# EAGLE schematic V1 (EAGLE 6.5.0)
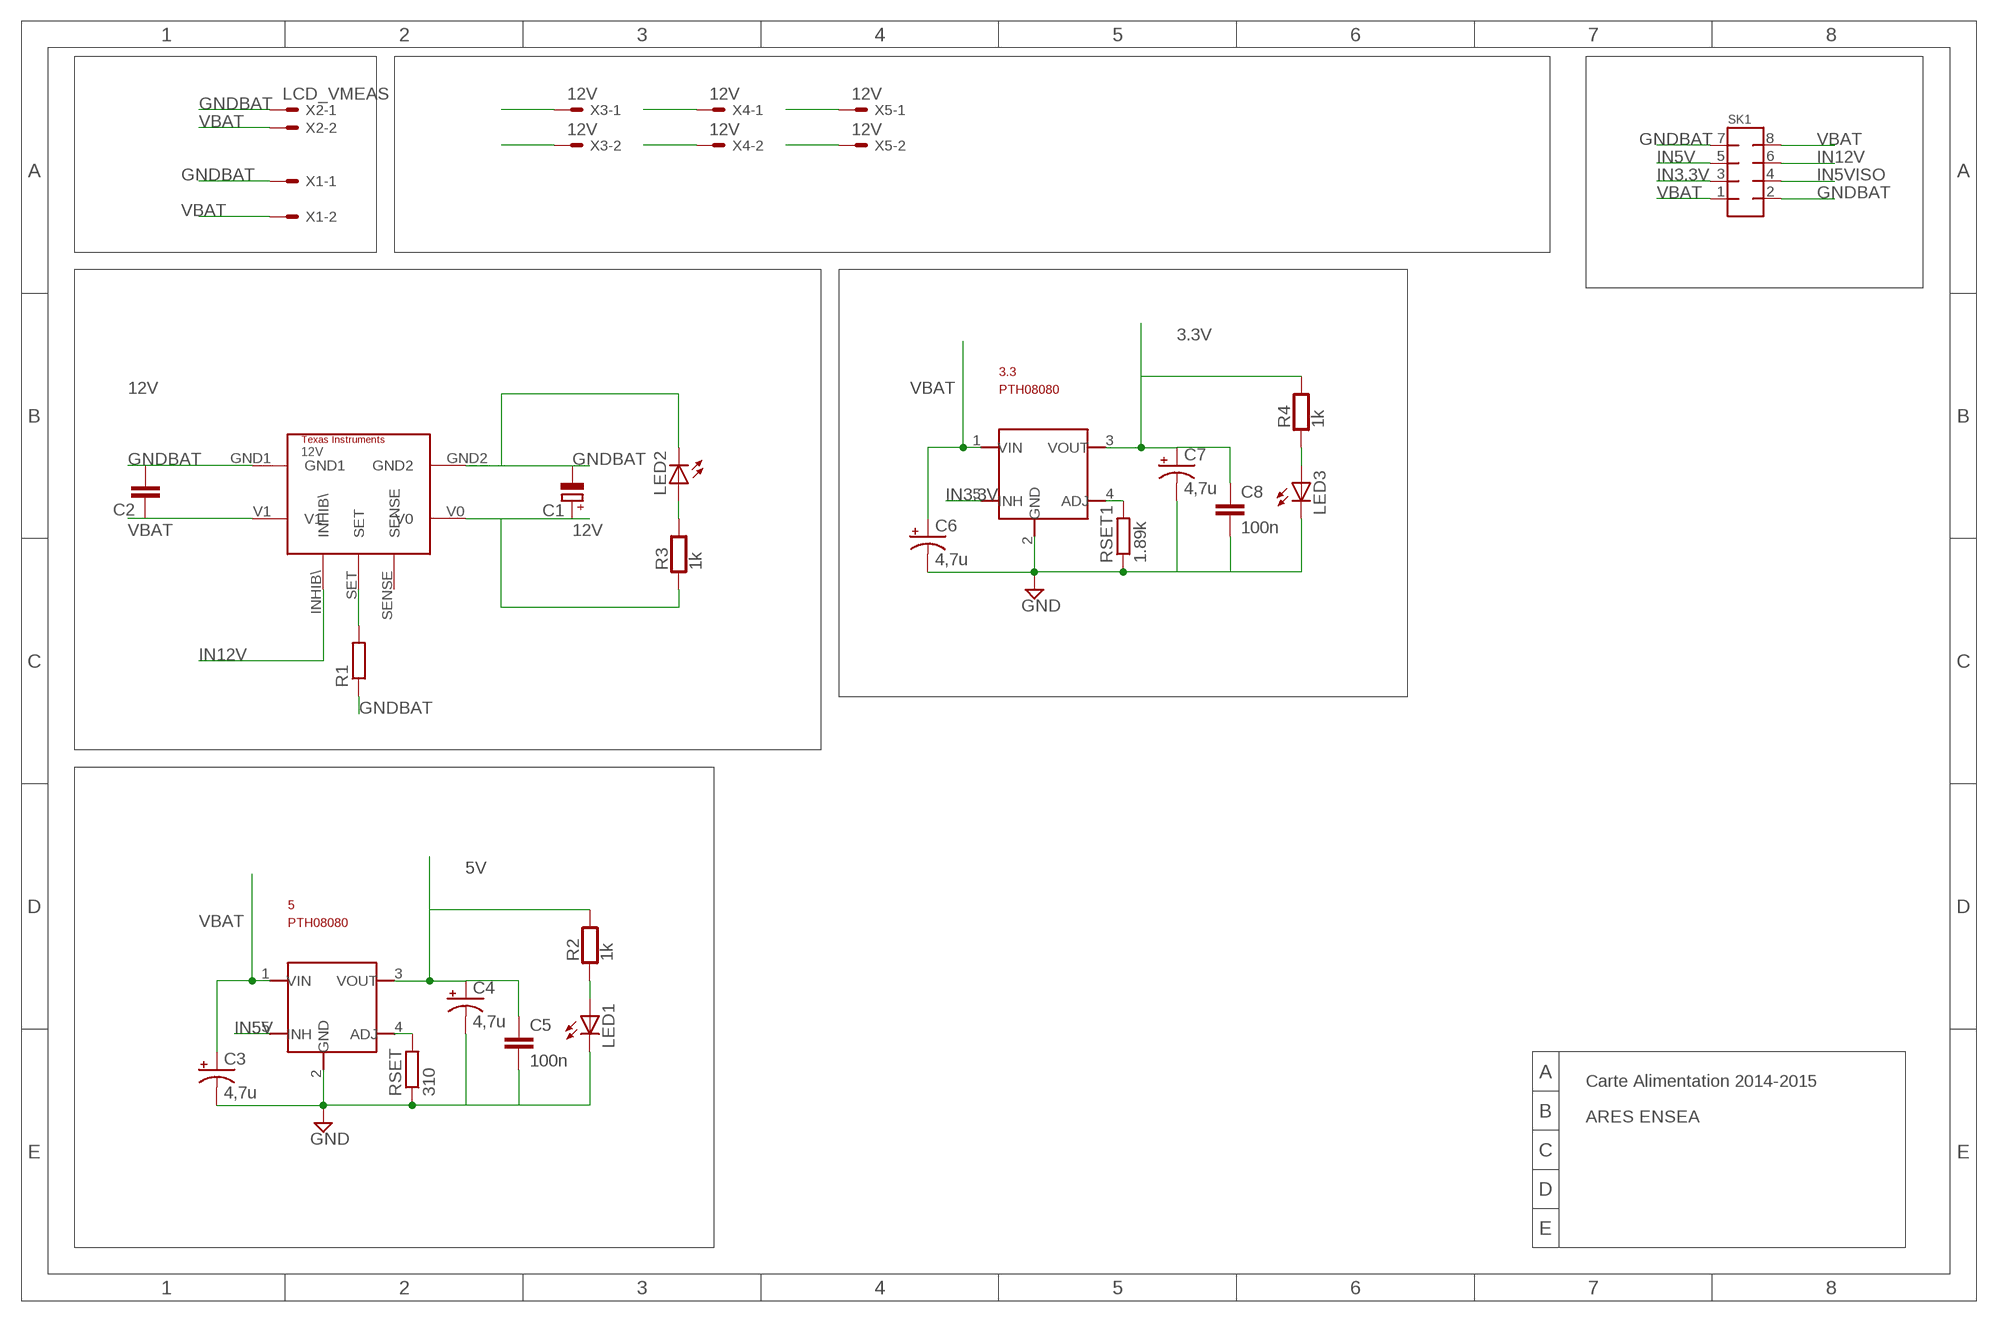
[diagram p0: schematic, sheet 1]

## Parts
3.3  PTH08080  [PTH08080EUF]
5  PTH08080  [PTH08080EUF]
12V  PTN78060W  [PTN78060W]
C1  CPOL-EUE2-4  [E2-4]
C2  C-EU025-024X044  [C025-024X044]
C3  4,7u  CAP_POLPTH2  [CPOL-RADIAL-10UF-25V]
C4  4,7u  CAP_POLPTH2  [CPOL-RADIAL-10UF-25V]
C5  100n  CAPPTH2  [CAP-PTH-SMALL2]
C6  4,7u  CAP_POLPTH2  [CPOL-RADIAL-10UF-25V]
C7  4,7u  CAP_POLPTH2  [CPOL-RADIAL-10UF-25V]
C8  100n  CAPPTH2  [CAP-PTH-SMALL2]
LED1  LEDSML0805  [SML0805]
LED2  LEDSML0805  [SML0805]
LED3  LEDSML0805  [SML0805]
R1  R-EU_M0805  [M0805]
R2  1k  R0805  [0805]
R3  1k  R0805  [0805]
R4  1k  R0805  [0805]
RSET  310  R-EU_R0805  [R0805]
RSET1  1.89k  R-EU_R0805  [R0805]
SK1  MMATCH-8-PTH  [AMP-215079-8]
X1  KK-156-2  [KK-156-2]
X2  LCD_VMEAS  22-23-2021  [22-23-2021]
X3  12V  KK-156-2  [KK-156-2]
X4  12V  KK-156-2  [KK-156-2]
X5  12V  KK-156-2  [KK-156-2]

## Nets
3.3V [pow]: 3.3.3(VOUT) C7.1(+) C8.1 R4.2
5V [pow]: 5.3(VOUT) C4.1(+) C5.1 R2.2
12V: 12V.V0 C1.+ R3.1 X3.1
12V1: X4.1
12V2: X5.1
GNDBAT: 3.3.2(GND) 5.2(GND) 12V.GND1 12V.GND2 C1.- C2.2 C3.2(-) C4.2(-) C5.2 C6.2(-) C7.2(-) C8.2 LED1.C LED2.C LED3.C R1.1 RSET1.1 RSET.1 SK1.2 SK1.7 X1.1 X2.1 X3.2 ; supply symbol labelled GND
GNDBAT1: X4.2
GNDBAT2: X5.2
IN3.3V: 3.3.5(INH) SK1.3
IN5V: 5.5(INH) SK1.5
IN5VISO: SK1.4
IN12V: 12V.INHIB\ SK1.6
N$2: LED1.A R2.1
N$3: LED2.A R3.2
N$4: 3.3.4(ADJ) RSET1.2
N$5: 5.4(ADJ) RSET.2
N$6: 12V.SET R1.2
N$8: LED3.A R4.1
VBAT: 3.3.1(VIN) 5.1(VIN) 12V.V1 C2.1 C3.1(+) C6.1(+) SK1.1 SK1.8 X1.2 X2.2
Unconnected: 12V.SENSE

## Notes on the sheet
- 12V
- Carte Alimentation 2014-2015
- ARES ENSEA

## Library data of the parts
3.3 5 = PTH08080:PTH08080: DC-DC, Vin 5..18V, Vout 2..6V, 2A www.ti.com
12V = PT:PTN78060W: PTN78060W : 3-A, Wide-Input, Adjustable Switching Regulator Module http://www.ti.com/lit/gpn/ptn78060w
C1 = rcl:CPOL-EU: POLARIZED CAPACITOR, European symbol
C2 = rcl:C-EU: CAPACITOR, European symbol
C3 C4 C6 C7 = SparkFun-Passives:CAP_POL: Capacitor Polarized These are standard SMD and PTH capacitors. Normally 10uF, 47uF, and 100uF in electrolytic and tantalum varieties. Always verify the external diameter of the through hole cap, it varies with capacity, voltage, and manufacturer. The EIA devices should be standard.
C5 C8 = SparkFun-Passives:CAP: Capacitor Standard 0603 ceramic capacitor, and 0.1" leaded capacitor.
LED1-LED3 = led:LED: LED OSRAM: - CHIPLED LG R971, LG N971, LY N971, LG Q971, LY Q971, LO R971, LY R971 LH N974, LH R974 LS Q976, LO Q976, LY Q976 LO Q996 - Hyper CHIPLED LW Q18S LB Q993, LB Q99A, LB R99A - SideLED LS A670, LO A670, LY A670, LG A670, LP A670 LB A673, LV A673, LT A673, LW A673 LH A674 LY A675 LS A676, LA A676, LO A676, LY A676, LW A676 LS A679, LY A679, LG A679 - Hyper Micro SIDELED® LS Y876, LA Y876, LO Y876, LY Y876 LT Y87S - SmartLED LW L88C, LW L88S LB L89C, LB L89S, LG L890 LS L89K, LO L89K, LY L89K LS L896, LA L896, LO L896, LY L896 - TOPLED LS T670, LO T670, LY T670, LG T670, LP T670 LSG T670, LSP T670, LSY T670, LOP T670, LYG T670 LG T671, LOG T671, LSG T671 LB T673, LV T673, LT T673, LW T673 LH T674 LS T676, LA T676, LO T676, LY T676, LB T676, LH T676, LSB T676, LW T676 LB T67C, LV T67C, LT T67C, LS T67K, LO T67K, LY T67K, LW E67C LS E67B, LA E67B, LO E67B, LY E67B, LB E67C, LV E67C, LT E67C LW T67C LS T679, LY T679, LG T679 LS T770, LO T770, LY T770, LG T770, LP T770 LB T773, LV T773, LT T773, LW T773 LH T774 LS E675, LA E675, LY E675, LS T675 LS T776, LA T776, LO T776, LY T776, LB T776 LHGB T686 LT T68C, LB T68C - Hyper Mini TOPLED® LB M676 - Mini TOPLED Santana® LG M470 LS M47K, LO M47K, LY M47K Source: http://www.osram.convergy.de LUXEON: - LUMILED® LXK2-PW12-R00, LXK2-PW12-S00, LXK2-PW14-U00, LXK2-PW14-V00 LXK2-PM12-R00, LXK2-PM12-S00, LXK2-PM14-U00 LXK2-PE12-Q00, LXK2-PE12-R00, LXK2-PE12-S00, LXK2-PE14-T00, LXK2-PE14-U00 LXK2-PB12-K00, LXK2-PB12-L00, LXK2-PB12-M00, LXK2-PB14-N00, LXK2-PB14-P00, LXK2-PB14-Q00 LXK2-PR12-L00, LXK2-PR12-M00, LXK2-PR14-Q00, LXK2-PR14-R00 LXK2-PD12-Q00, LXK2-PD12-R00, LXK2-PD12-S00 LXK2-PH12-R00, LXK2-PH12-S00 LXK2-PL12-P00, LXK2-PL12-Q00, LXK2-PL12-R00 Source: www.luxeon.com KINGBRIGHT: KA-3528ASYC Source: www.kingbright.com
R1 = resistor:R-EU_: RESISTOR, European symbol
R2-R4 = mbed-rlcq:R
RSET RSET1 = rcl:R-EU_: RESISTOR, European symbol
SK1 = jt-con-micromatch:MMATCH-8-*: AMP Micromatch 8-pin
X1 X3-X5 = con-molex:KK-156-2: KK 156 HEADER Source: http://www.molex.com/pdm_docs/sd/026604100_sd.pdf; OC_FARNELL: unknown; OC_NEWARK: unknown
X2 = con-molex:22-23-2021: .100" (2.54mm) Center Header - 2 Pin; MF: MOLEX; MPN: 22-23-2021; OC_FARNELL: 1462926; OC_NEWARK: 25C3832

## Net classes
1 pow: width 0.508 mm